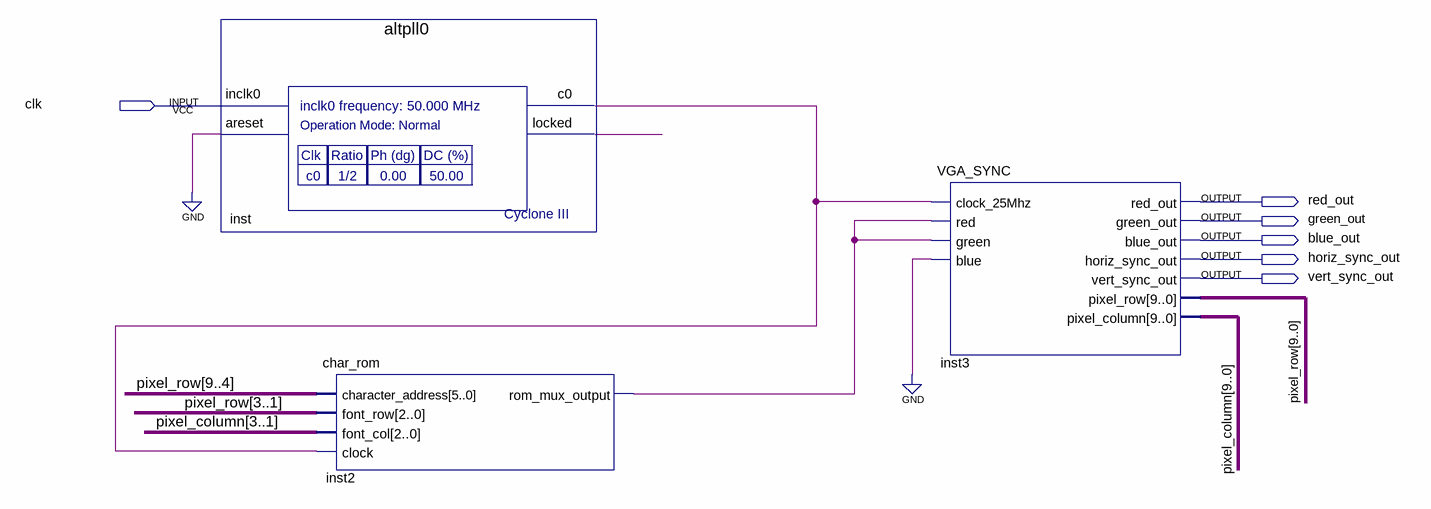
[diagram p0: schematic sheet]
// Quartus schematic TextDisplay.bdf as structural Verilog: 3 symbols, 6 pins
module TextDisplay (
  input  clk,
  output red_out,
  output green_out,
  output blue_out,
  output horiz_sync_out,
  output vert_sync_out
);

  wire inst2_rom_mux_output, inst_c0, inst_locked;
  wire [9:0] pixel_column, pixel_row;

  altpll0 inst (.inclk0(clk), .areset(1'b0), .c0(inst_c0), .locked(inst_locked));
  char_rom inst2 (
    .character_address(pixel_row[9:4]), .font_row(pixel_row[3:1]), .font_col(pixel_column[3:1]),
    .clock(inst_c0), .rom_mux_output(inst2_rom_mux_output));
  VGA_SYNC inst3 (
    .clock_25Mhz(inst_c0), .red(inst2_rom_mux_output), .green(inst2_rom_mux_output), .blue(1'b0),
    .red_out(red_out), .green_out(green_out), .blue_out(blue_out), .horiz_sync_out(horiz_sync_out),
    .vert_sync_out(vert_sync_out), .pixel_row(pixel_row), .pixel_column(pixel_column));
endmodule
